# EAGLE design blinkm_mk2r (EAGLE 6.6.0)
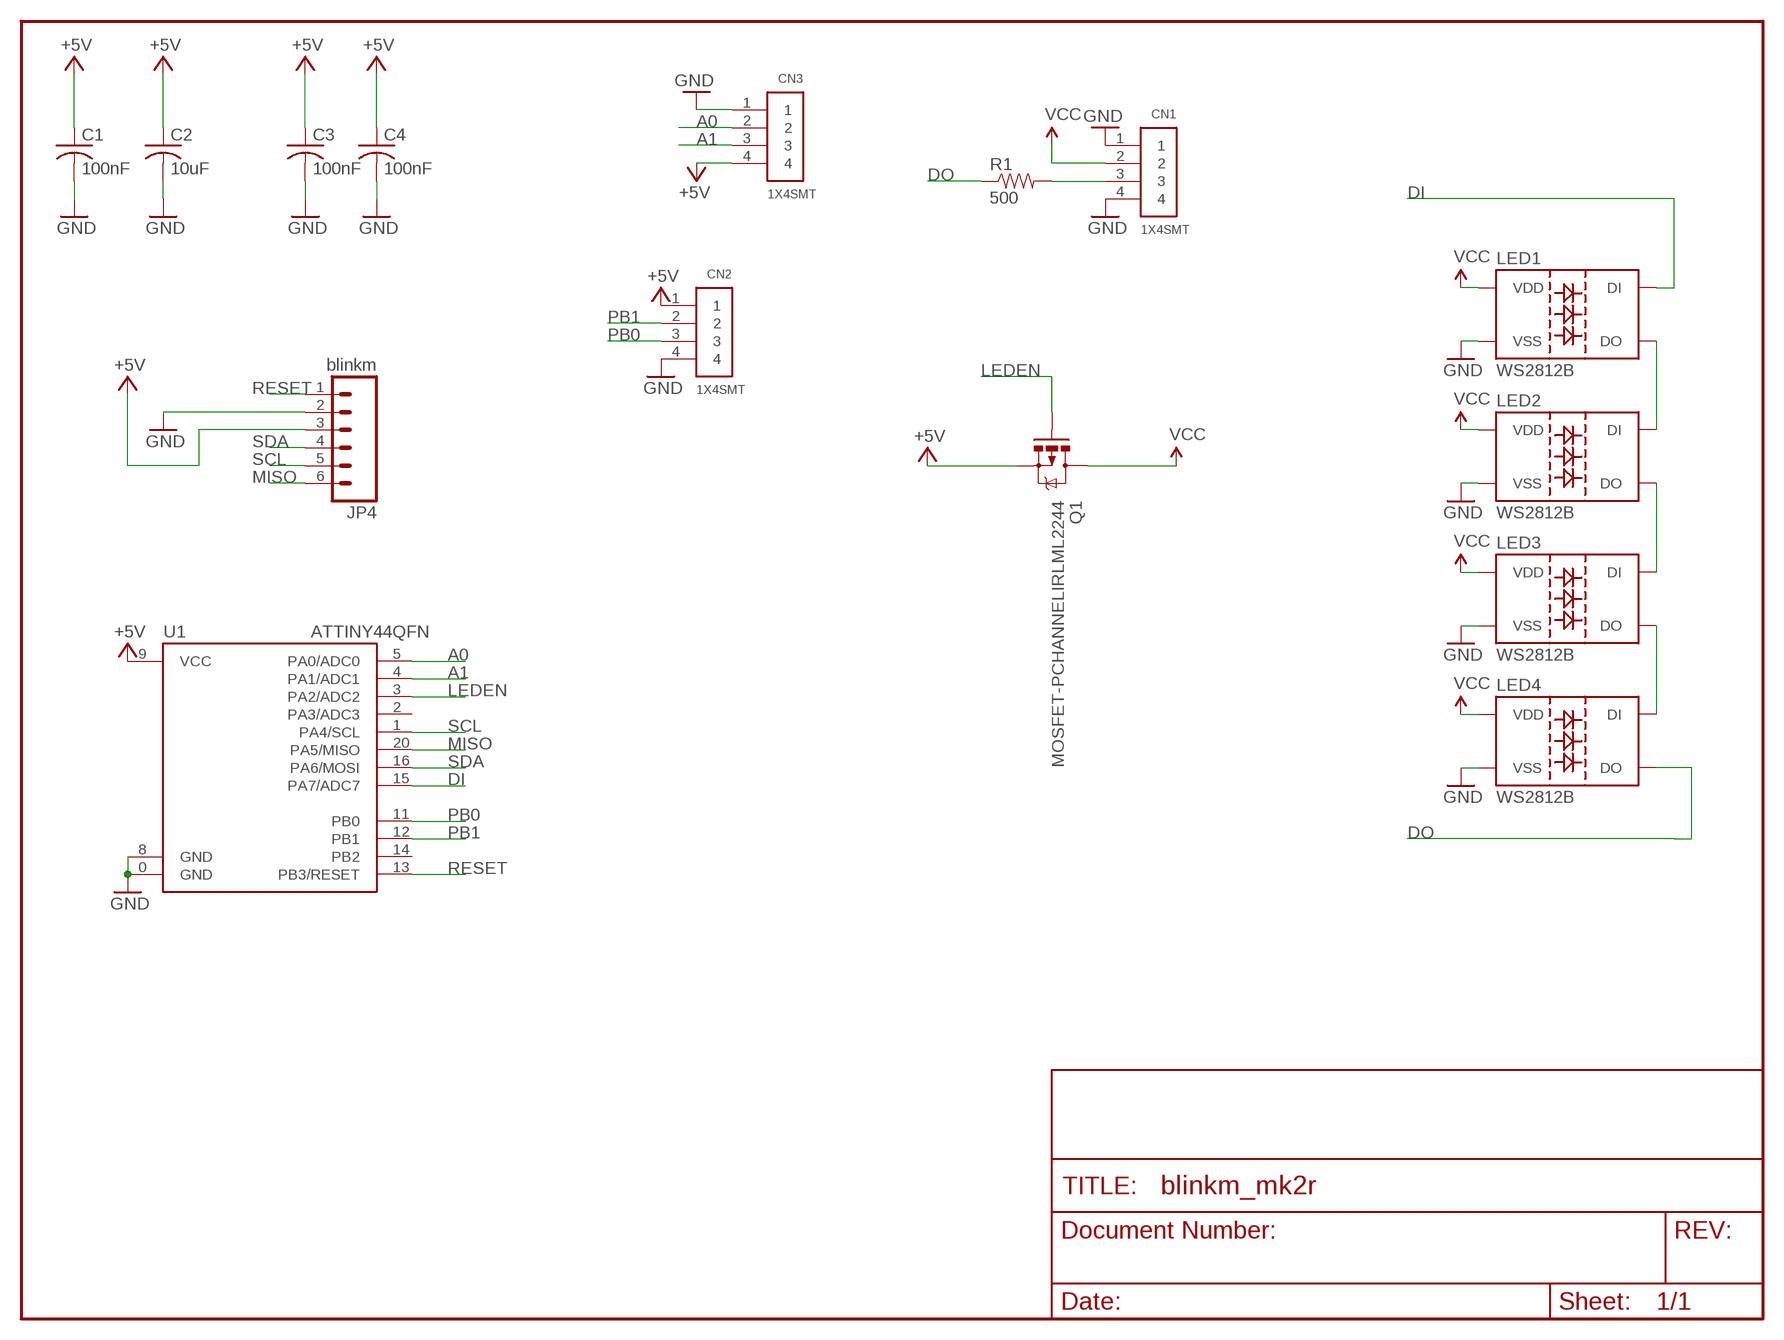
[diagram p0: schematic, sheet 1]

## Parts
C1  100nF  C-USC0603  [C0603]
C2  10uF  C-USC0603  [C0603]
C3  100nF  C-USC0603  [C0603]
C4  100nF  C-USC0603  [C0603]
CN1  1X4SMT  [1X4-SMT]
CN2  1X4SMT  [1X4-SMT]
CN3  1X4SMT  [1X4-SMT]
JP4  blinkm  M06LOCK  [1X06_LOCK]
LED1  WS2812B  [WS2812B]
LED2  WS2812B  [WS2812B]
LED3  WS2812B  [WS2812B]
LED4  WS2812B  [WS2812B]
Q1  MOSFET-PCHANNELIRLML2244  [SOT23-3]
R1  500  RESISTOR0603  [0603-RES]
U1  ATTINY44QFN  ATTINY24QFN  [QFN20]

## Nets
+5V: C1.1 C2.1 C3.1 C4.1 CN2.1 CN3.4 JP4.3 Q1.2(S) U1.9(VCC)
A0: CN3.2 U1.5(PA0/ADC0)
A1: CN3.3 U1.4(PA1/ADC1)
DI: LED1.4(DI) U1.15(PA7/ADC7)
DO: LED4.2(DO) R1.1
DOI1: LED1.2(DO) LED2.4(DI)
DOI2: LED2.2(DO) LED3.4(DI)
GND: C1.2 C2.2 C3.2 C4.2 CN1.1 CN1.4 CN2.4 CN3.1 JP4.2 LED1.3(VSS) LED2.3(VSS) LED3.3(VSS) LED4.3(VSS) U1.0(GND) U1.8(GND)
LEDEN: Q1.1(G) U1.3(PA2/ADC2)
MISO: JP4.6 U1.20(PA5/MISO)
N$1: CN1.3 R1.2
N$2: LED3.2(DO) LED4.4(DI)
PB0: CN2.3 U1.11(PB0)
PB1: CN2.2 U1.12(PB1)
RESET: JP4.1 U1.13(PB3/RESET)
SCL: JP4.5 U1.1(PA4/SCL)
SDA: JP4.4 U1.16(PA6/MOSI)
VCC: CN1.2 LED1.1(VDD) LED2.1(VDD) LED3.1(VDD) LED4.1(VDD) Q1.3(D)
Unconnected: U1.2(PA3/ADC3) U1.14(PB2)

## Library data of the parts
C1-C4 = rcl:C-US: CAPACITOR, American symbol
CN1-CN3 = adafruit:1X4: 4-pin connector
JP4 = SparkFun-Connectors:M06: Header 6 Standard 6-pin 0.1" header. Use with straight break away headers (SKU : PRT-00116), right angle break away headers (PRT-00553), swiss pins (PRT-00743), machine pins (PRT-00117), and female headers (PRT-00115). Molex polarized connector foot print use with SKU : PRT-08094 with associated crimp pins and housings. NOTES ON THE VARIANTS LOCK and LOCK_LONGPADS... This footprint was designed to help hold the alignment of a through-hole component (i.e. 6-pin header) while soldering it into place. You may notice that each hole has been shifted either up or down by 0.005 of an inch from it's more standard position (which is a perfectly straight line). This slight alteration caused the pins (the squares in the middle) to touch the edges of the holes. Because they are alternating, it causes a "brace" to hold the component in place. 0.005 has proven to be the perfect amount of "off-center" position when using our standard breakaway headers. Although looks a little odd when you look at the bare footprint, once you have a header in there, the alteration is very hard to notice. Also, if you push a header all the way into place, it is covered up entirely on the bottom side. This idea of altering the position of holes to aid alignment will be further integrated into the Sparkfun Library for other footprints. It can help hold any component with 3 or more connection pins.
LED1-LED4 = WS2812:WS2812B
Q1 = SparkFun-DiscreteSemi:MOSFET-PCHANNEL: Generic PMOSFET; PROD_ID: TRANS-11153
R1 = SparkFun-Resistors:RESISTOR: Resistor Basic schematic elements and footprints for 0603, 1206, and PTH resistors.
U1 = SparkFun-DigitalIC:ATTINY24: Atmel 20-pin 2kB flash uC

## Board
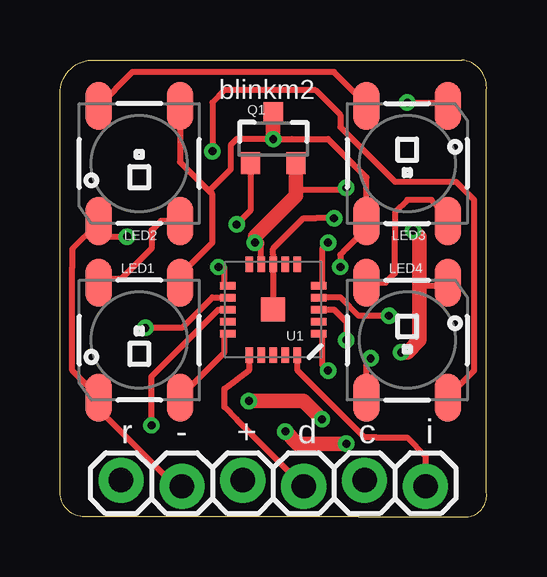
[diagram p1: board, top side]
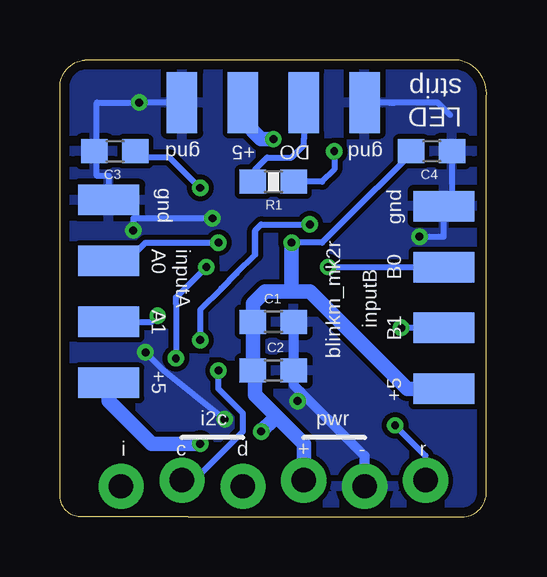
[diagram p2: board, bottom side, seen from below]

Size 17.79 x 19.05 mm. Coordinates in mm from the lower left corner, seen from the top.
Outline: 12.45,0 1.02,0 arc-90 0.01,1.02 0.01,17.53 arc-90 1.28,19.05 16.77,19.05 arc-90 17.79,17.78 17.79,1.02 arc-90 17.02,0 12.45,0
Copper layers (1*16): Top 0.0356mm / dielectric 1.5011mm / Bottom 0.0356mm
Design rules "LaenPCBOrder-tod *": minimum track width 10mil, minimum drill 13mil, track to track 8mil, track to pad 8mil, pad to pad 8mil, via to via 8mil, smd to smd 6mil, copper to edge 15mil, drill to drill 8mil, minimum pad ring 7mil, minimum via ring 7mil, stop-mask expansion 4mil, vias tented up to drill 25mil, thermal gap 10mil
tRestrict: area 7.9,7.6 to 9.9,9.7
vRestrict: area 6.9,9.1 to 8.9,11.2

### Footprints (pad centres in the part's own frame; a part is rotated, then mirrored left to right if it is on the bottom)
C0603 = smd 1.1 x 1: 1 -0.85,0; 2 0.85,0
1X4-SMT = smd 1.27 x 2.54: 1 -3.81,0; 2 -1.27,0; 3 1.27,0; 4 3.81,0
1X06_LOCK = drill 1.016 pad 1.88: 1 0,0; 2 2.54,-0.254; 3 5.08,0; 4 7.62,-0.254; 5 10.16,0; 6 12.7,-0.254
WS2812B = smd 2 x 1.1: 1 2.4,-1.7; 2 2.4,1.7; 3 -2.4,1.7; 4 -2.4,-1.7
SOT23-3 = smd 0.8 x 0.9: 1 -0.95,-1; 2 0.95,-1; 3 0,1.1
0603-RES = smd 1.1 x 1: 1 -0.85,0; 2 0.85,0
QFN20 = smd 1 x 1: 0 0,0 | smd 0.65 x 0.3: 1 -1.9,1; 2 -1.9,0.5; 3 -1.9,0; 4 -1.9,-0.5; 5 -1.9,-1; 11 1.9,-1; 12 1.9,-0.5; 13 1.9,0; 14 1.9,0.5; 15 1.9,1 | smd 0.3 x 0.65: 6 -1,-1.9; 7 -0.5,-1.9; 8 0,-1.9; 9 0.5,-1.9; 10 1,-1.9; 16 1,1.9; 17 0.5,1.9; 18 0,1.9; 19 -0.5,1.9; 20 -1,1.9

### Placement (x,y rotation side)
C1  8.9,8.13 0 bottom
C2  8.9,6.1 0 bottom
C3  15.5,15.24 180 bottom
C4  2.29,15.24 0 bottom
CN1  8.9,17.27 0 bottom
CN2  1.78,9.14 90 bottom
CN3  15.75,9.4 270 bottom
JP4  2.55,1.52 0 top
LED1  3.31,7.37 90 top
LED2  3.31,14.73 90 top
LED3  14.48,14.73 270 top
LED4  14.48,7.37 270 top
Q1  8.9,15.75 0 top
R1  8.9,13.97 180 bottom
U1  8.9,8.64 180 top

### Tracks (layer width: path | path; a pad name or v marks a point on that pad's centre or on a via)
+5V  (via drill 0.33)
  Top 0.254: U1.9 8.4,11.35 | 8.4,11.35 8.4,11.44 | 8.4,11.44 8.4,11.35 | 8.4,11.35 8.4,11.44 | 8.4,11.44 8.4,11.35 | 8.4,11.35 8.4,11.44 | 8.4,11.44 v8.13,11.43 | 9.85,13.65 11.88,13.65 v11.94,13.72
  Top 0.61: Q1.2 9.85,13.65 9.85,13.4 9.66,13.21 8.13,11.68 v8.13,11.43 | v11.94,3.05 9.91,3.05 v9.4,3.56
  Bottom 0.254: C4.1 3.31,14.99 5.85,12.45 6.86,11.43 v8.13,11.43 | 9.66,8.64 9.75,8.89 | v11.94,13.72 13.21,14.99 14.48,14.99 C3.1 | 8.9,4.06 8.77,4.19
  Bottom 0.406: 9.66,6.01 C2.1 | 8.13,9.4 9.24,9.4
  Bottom 0.61: JP4.3 7.63,3.05 8.77,4.19 9.66,5.08 9.66,6.01 | C2.1 C1.1 9.75,8.89 9.24,9.4 8.13,9.4 | CN2.1 3.31,5.33 7.37,9.4 8.13,9.4 | v8.13,11.43 8.13,9.4 | 8.9,4.06 v9.4,3.56 | v11.94,3.05 13.98,3.05 15.75,4.83 CN3.4
A0  (via drill 0.33)
  Top 0.254: v11.18,11.43 10.93,11.18 10.93,9.65 U1.5
  Bottom 0.254: v11.18,11.43 14.23,11.43 14.99,10.67 CN3.2
A1  (via drill 0.33)
  Top 0.254: v13.72,8.38 12.45,8.38 11.69,9.14 10.93,9.14 U1.4
  Bottom 0.254: CN3.3 13.98,8.13 v13.72,8.38
DI
  Top 0.254: U1.15 6.86,7.62 6.86,6.86 5.09,5.08 LED1.4
DO  (via drill 0.33)
  Top 0.254: LED4.2 16.26,5.08 17.28,6.1 17.28,13.21 16.52,13.97 13.98,13.97 11.69,16.26 11.69,16.76 10.67,17.78 6.86,17.78 6.36,17.27 v6.36,15.24
  Bottom 0.254: v6.36,15.24 6.36,14.48 6.86,13.97 R1.1
DOI1
  Top 0.254: LED1.2 1.78,9.91 2.55,9.91 3.82,11.18 3.82,11.94 4.21,12.33 LED2.4
DOI2
  Top 0.254: 1.78,17.27 LED2.2 3.02,18.54 3.56,18.54 11.44,18.54 12.71,17.27 LED3.4
GND  (via drill 0.33)
  Top 0.254: U1.0 U1.8 8.9,10.67 8.9,10.92 8.9,11.18 10.17,12.45 10.67,12.45 v11.44,12.45 | v14.48,17.27 16.01,17.27 LED3.3 | JP4.2 4.83,1.27 1.78,4.32 1.78,4.83 LED1.3 1.53,5.08 0.51,6.1 0.51,10.41 0.51,11.18 1.53,12.19 LED2.3 1.53,11.68 v2.8,11.68 | 16.01,9.65 LED4.3 | 16.26,9.69 LED4.3 | 14.99,9.65 15.82,9.65 LED4.3
  Top 0.61: v14.23,6.86 14.48,6.86 14.99,7.37 14.99,9.65 14.99,11.68 v14.74,11.94 | v7.88,4.83 10.17,4.83 v10.93,4.06
  Bottom 0.254: CN1.1 v14.48,17.27 14.74,17.27 16.26,17.27 16.26,14.22 15.75,14.22 CN3.1 | v11.44,12.45 14.74,12.45 v14.74,11.94 | 3.82,17.27 4.07,17.27 | 4.07,17.27 CN1.4 | v2.8,11.68 1.78,11.68 CN2.4 arc-90 1.44,13.3 C4.2 | v14.23,6.86 13.47,6.1 v10.93,4.06 | v7.88,4.83 7.88,5.08 7.75,5.21 | 1.53,16.76 2.04,17.27 3.82,17.27 | 3.82,17.27 4.07,17.27 | 4.07,17.27 3.82,17.27
  Bottom 0.406: C1.2 C2.2 8.05,5.5 7.75,5.21 6.61,4.06 5.09,2.54 JP4.2
  pour Bottom: 0.01,19.05 0.01,0 27.95,0 27.95,19.05
  pour Top: 25.41,19.05 25.41,-2.54 21.6,-2.54 21.6,19.05
LEDEN  (via drill 0.33)
  Top 0.254: U1.3 10.93,8.64 11.05,8.64 11.44,8.64 11.94,8.13 v11.94,7.37 | Q1.1 7.95,12.77 7.63,12.45 v7.37,12.19
  Bottom 0.254: 10.42,10.16 11.05,9.53 | 11.05,9.53 10.42,10.16 | 10.42,10.16 9.66,10.92 | 9.66,10.92 9.66,11.94 | 9.66,11.94 9.66,10.92 | 9.66,10.92 9.66,11.94 | 9.66,11.94 9.4,12.19 v7.37,12.19 | 11.05,9.53 11.94,8.64 v11.94,7.37
MISO
  Top 0.254: U1.20 9.91,6.6 9.91,6.1 10.17,5.84 11.44,4.57 12.71,3.3 13.21,3.3 14.48,3.3 15.25,2.54 JP4.6
N$1
  Bottom 0.254: CN1.3 7.63,15.75 7.63,15.49 8.13,14.99 9.15,14.99 9.66,14.48 9.66,13.97 R1.2
N$2
  Top 0.254: LED3.2 16.01,12.45 16.01,12.7 15.5,13.21 14.74,13.21 14.48,13.21 13.98,12.7 13.98,11.68 13.98,10.16 13.58,9.77 LED4.4
PB0  (via drill 0.33)
  Top 0.254: U1.11 6.86,9.65 6.86,10.41 v6.61,10.41
  Bottom 0.254: 2.04,10.67 CN2.3 v6.61,10.41
PB1  (via drill 0.33)
  Top 0.254: U1.12 6.86,9.14 6.36,9.14 5.09,7.87 v3.56,7.87
  Bottom 0.254: v3.56,7.87 2.04,7.87 CN2.2
RESET  (via drill 0.33)
  Top 0.254: v3.82,3.81 3.82,5.84 6.61,8.64 6.86,8.64 U1.13
  Bottom 0.254: JP4.1 2.55,2.54 v3.82,3.81
SCL  (via drill 0.33)
  Top 0.254: U1.1 10.93,7.62 10.93,6.35 v11.18,6.1
  Bottom 0.254: JP4.5 12.2,1.52 10.17,3.56 10.17,4.06 10.17,4.32 11.18,5.33 v11.18,6.1
SDA
  Top 0.254: U1.16 7.9,6.37 7.88,6.1 6.86,5.33 6.86,4.57 7.37,4.06 JP4.4
VCC  (via drill 0.33)
  Top 0.254: LED1.1 5.09,9.91 5.09,10.16 6.36,11.43 6.36,13.45 6.22,13.58 | LED4.1 12.78,6.35 v12.96,6.6 | v11.69,10.41 11.69,10.92 11.94,11.18 12.71,11.94 12.71,12.19 LED3.1 12.78,14.15 12.45,14.48 12.2,14.73 11.94,14.99 11.18,15.75 9.66,15.75 9.15,15.75 v8.9,15.75 7.37,15.75 7.29,15.67 7.12,15.49 7.12,14.48 6.22,13.58 | 6.22,13.58 5.09,14.72 5.01,14.79 LED2.1
  Top 0.61: Q1.3 v8.9,15.75
  Bottom 0.254: 10.17,17.02 CN1.2 10.17,16.51 | v12.96,6.6 12.96,8.89 12.96,9.14 v11.69,10.41
  Bottom 0.61: v8.9,15.75 9.4,15.75 10.17,16.51

### Text on the board
tPlace: blinkm2 | r | - | + | d | c | i
bPlace: LED / strip | gnd | DO | +5 | gnd | gnd | gnd | inputA | A0 | B0 | A1 | inputB | B1 | blinkm_mk2r | +5 | +5 | pwr | i2c | r | - | + | d | c | i